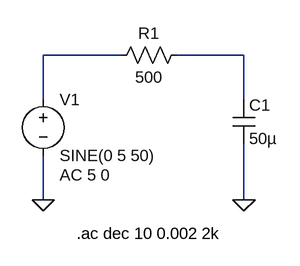
[diagram p0: schematic LowPass.asc]
LowPass.asc, the LTspice schematic file:
Version 4.1
SHEET 1 880 680
WIRE 64 0 -48 0
WIRE 240 0 144 0
WIRE -48 64 -48 0
WIRE 240 64 240 0
WIRE -48 208 -48 144
WIRE 240 208 240 128
FLAG -48 208 0
FLAG 240 208 0
SYMBOL voltage -48 48 R0
WINDOW 123 24 124 Left 2
WINDOW 39 0 0 Left 0
SYMATTR InstName V1
SYMATTR Value SINE(0 5 50)
SYMATTR Value2 AC 5 0
SYMBOL res 48 16 R270
WINDOW 0 32 56 VTop 2
WINDOW 3 0 56 VBottom 2
SYMATTR InstName R1
SYMATTR Value 500
SYMBOL cap 224 64 R0
SYMATTR InstName C1
SYMATTR Value 50µ
TEXT 0 256 Left 2 !.ac dec 10 0.002 2k

The netlist it stands for:
* LowPass.asc
V1 N001 0 SINE(0 5 50) AC 5 0
R1 N001 N002 500
C1 N002 0 50µ
.ac dec 10 0.002 2k
.backanno
.end